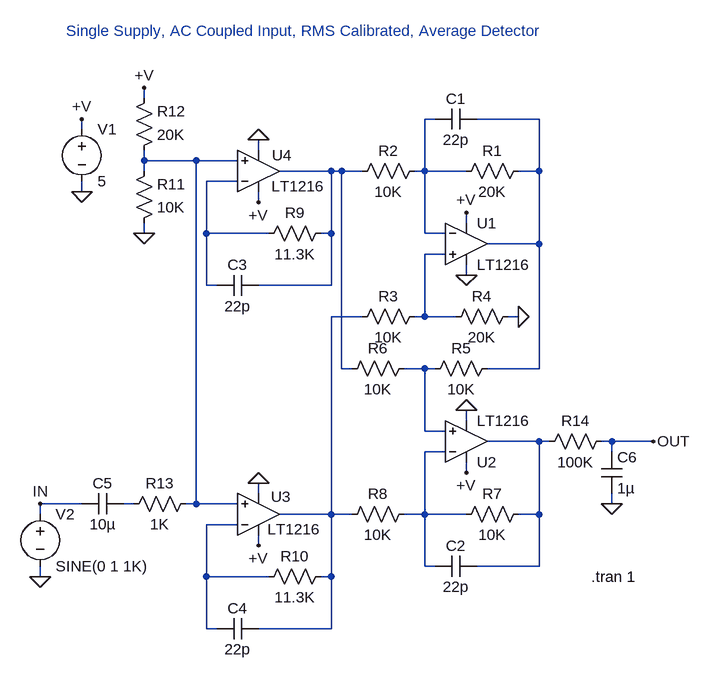
[diagram p0: schematic 1216.asc]
1216.asc, the LTspice schematic file:
Version 4
SHEET 1 896 848
WIRE -432 -64 -432 -80
WIRE 16 -32 0 -32
WIRE 176 -32 80 -32
WIRE -528 -16 -528 -32
WIRE -256 16 -256 0
WIRE -432 32 -432 16
WIRE -352 32 -432 32
WIRE -288 32 -352 32
WIRE -432 48 -432 32
WIRE -144 48 -224 48
WIRE -128 48 -144 48
WIRE -96 48 -128 48
WIRE 0 48 0 -32
WIRE 0 48 -16 48
WIRE 64 48 0 48
WIRE 176 48 176 -32
WIRE 176 48 144 48
WIRE -288 64 -336 64
WIRE -528 80 -528 64
WIRE -256 96 -256 80
WIRE 64 128 64 112
WIRE -432 144 -432 128
WIRE -336 144 -336 64
WIRE -240 144 -336 144
WIRE -144 144 -144 48
WIRE -144 144 -160 144
WIRE 0 144 0 48
WIRE 32 144 0 144
WIRE 176 160 176 48
WIRE 176 160 96 160
WIRE 32 176 0 176
WIRE 64 208 64 192
WIRE -336 224 -336 144
WIRE -320 224 -336 224
WIRE -144 224 -144 144
WIRE -144 224 -256 224
WIRE -96 272 -144 272
WIRE 0 272 0 176
WIRE 0 272 -16 272
WIRE 48 272 0 272
WIRE 144 272 128 272
WIRE -128 352 -128 48
WIRE -112 352 -128 352
WIRE 0 352 -32 352
WIRE 16 352 0 352
WIRE 176 352 176 160
WIRE 176 352 96 352
WIRE 64 432 64 416
WIRE 0 448 0 352
WIRE 32 448 0 448
WIRE 176 464 96 464
WIRE 192 464 176 464
WIRE 288 464 272 464
WIRE 352 464 288 464
WIRE 32 480 0 480
WIRE 288 480 288 464
WIRE 64 512 64 496
WIRE -256 544 -256 528
WIRE -528 560 -592 560
WIRE -448 560 -464 560
WIRE -352 560 -352 32
WIRE -352 560 -368 560
WIRE -288 560 -352 560
WIRE 288 560 288 544
WIRE -592 576 -592 560
WIRE -144 576 -144 272
WIRE -144 576 -224 576
WIRE -112 576 -144 576
WIRE 0 576 0 480
WIRE 0 576 -32 576
WIRE 64 576 0 576
WIRE 176 576 176 464
WIRE 176 576 144 576
WIRE -288 592 -336 592
WIRE -256 624 -256 608
WIRE 0 656 0 576
WIRE 16 656 0 656
WIRE 176 656 176 576
WIRE 176 656 80 656
WIRE -592 672 -592 656
WIRE -336 672 -336 592
WIRE -240 672 -336 672
WIRE -144 672 -144 576
WIRE -144 672 -160 672
WIRE -336 752 -336 672
WIRE -320 752 -336 752
WIRE -144 752 -144 672
WIRE -144 752 -256 752
FLAG -528 80 0
FLAG 64 112 +V
FLAG -528 -32 +V
FLAG -592 672 0
FLAG 64 512 +V
FLAG 64 208 0
FLAG 64 416 0
FLAG -256 96 +V
FLAG -256 0 0
FLAG 144 272 0
FLAG -256 624 +V
FLAG -256 528 0
FLAG -432 144 0
FLAG -432 -80 +V
FLAG 288 560 0
FLAG 352 464 OUT
FLAG -592 560 IN
SYMBOL voltage -528 -32 R0
SYMATTR InstName V1
SYMATTR Value 5
SYMBOL res 160 32 R90
WINDOW 0 0 56 VBottom 2
WINDOW 3 32 56 VTop 2
SYMATTR InstName R1
SYMATTR Value 20K
SYMBOL res 0 32 R90
WINDOW 0 0 56 VBottom 2
WINDOW 3 32 56 VTop 2
SYMATTR InstName R2
SYMATTR Value 10K
SYMBOL voltage -592 560 R0
SYMATTR InstName V2
SYMATTR Value SINE(0 1 1K)
SYMBOL opamps\\LT1216 64 96 R0
SYMATTR InstName U1
SYMBOL opamps\\LT1216 64 528 M180
SYMATTR InstName U2
SYMBOL opamps\\LT1216 -256 112 M180
WINDOW 0 21 88 Left 2
WINDOW 3 20 41 Left 2
SYMATTR InstName U4
SYMBOL res 0 256 R90
WINDOW 0 0 56 VBottom 2
WINDOW 3 32 56 VTop 2
SYMATTR InstName R3
SYMATTR Value 10K
SYMBOL res 144 256 R90
WINDOW 0 0 56 VBottom 2
WINDOW 3 32 56 VTop 2
SYMATTR InstName R4
SYMATTR Value 20K
SYMBOL res 112 336 R90
WINDOW 0 0 56 VBottom 2
WINDOW 3 32 56 VTop 2
SYMATTR InstName R5
SYMATTR Value 10K
SYMBOL res -16 336 R90
WINDOW 0 0 56 VBottom 2
WINDOW 3 32 56 VTop 2
SYMATTR InstName R6
SYMATTR Value 10K
SYMBOL cap 80 -48 R90
WINDOW 0 0 32 VBottom 2
WINDOW 3 32 32 VTop 2
SYMATTR InstName C1
SYMATTR Value 22p
SYMBOL res 160 560 R90
WINDOW 0 0 56 VBottom 2
WINDOW 3 32 56 VTop 2
SYMATTR InstName R7
SYMATTR Value 10K
SYMBOL res -16 560 R90
WINDOW 0 0 56 VBottom 2
WINDOW 3 32 56 VTop 2
SYMATTR InstName R8
SYMATTR Value 10K
SYMBOL cap 80 640 R90
WINDOW 0 0 32 VBottom 2
WINDOW 3 32 32 VTop 2
SYMATTR InstName C2
SYMATTR Value 22p
SYMBOL res -144 128 R90
WINDOW 0 0 56 VBottom 2
WINDOW 3 32 56 VTop 2
SYMATTR InstName R9
SYMATTR Value 11.3K
SYMBOL cap -256 208 R90
WINDOW 0 0 32 VBottom 2
WINDOW 3 32 32 VTop 2
SYMATTR InstName C3
SYMATTR Value 22p
SYMBOL opamps\\LT1216 -256 640 M180
WINDOW 0 19 91 Left 2
WINDOW 3 14 41 Left 2
SYMATTR InstName U3
SYMBOL res -144 656 R90
WINDOW 0 0 56 VBottom 2
WINDOW 3 32 56 VTop 2
SYMATTR InstName R10
SYMATTR Value 11.3K
SYMBOL cap -256 736 R90
WINDOW 0 0 32 VBottom 2
WINDOW 3 32 32 VTop 2
SYMATTR InstName C4
SYMATTR Value 22p
SYMBOL res -448 144 M180
WINDOW 0 36 76 Left 2
WINDOW 3 36 40 Left 2
SYMATTR InstName R11
SYMATTR Value 10K
SYMBOL res -448 32 M180
WINDOW 0 36 76 Left 2
WINDOW 3 36 40 Left 2
SYMATTR InstName R12
SYMATTR Value 20K
SYMBOL res -352 544 R90
WINDOW 0 0 56 VBottom 2
WINDOW 3 32 56 VTop 2
SYMATTR InstName R13
SYMATTR Value 1K
SYMBOL cap -528 576 R270
WINDOW 0 32 32 VTop 2
WINDOW 3 0 32 VBottom 2
SYMATTR InstName C5
SYMATTR Value 10µ
SYMBOL res 288 448 R90
WINDOW 0 0 56 VBottom 2
WINDOW 3 32 56 VTop 2
SYMATTR InstName R14
SYMATTR Value 100K
SYMBOL cap 272 480 R0
SYMATTR InstName C6
SYMATTR Value 1µ
TEXT 256 672 Left 2 !.tran 1
TEXT -184 -152 Bottom 2 ;Single Supply, AC Coupled Input, RMS Calibrated, Average Detector

The netlist it stands for:
* 1216.asc
V1 +V 0 5
R1 N002 N001 20K
R2 N001 N004 10K
V2 IN 0 SINE(0 1 1K)
XU1 N006 N001 +V 0 N002 LT1216  ; pins In+ In- V+ V- OUT
XU2 N008 N010 +V 0 N009 LT1216  ; pins In+ In- V+ V- OUT
XU4 N003 N005 +V 0 N004 LT1216  ; pins In+ In- V+ V- OUT
R3 N006 N007 10K
R4 0 N006 20K
R5 N002 N008 10K
R6 N008 N004 10K
C1 N002 N001 22p
R7 N009 N010 10K
R8 N010 N007 10K
C2 N009 N010 22p
R9 N004 N005 11.3K
C3 N004 N005 22p
XU3 N003 N012 +V 0 N007 LT1216  ; pins In+ In- V+ V- OUT
R10 N007 N012 11.3K
C4 N007 N012 22p
R11 0 N003 10K
R12 N003 +V 20K
R13 N003 N011 1K
C5 IN N011 10µ
R14 OUT N009 100K
C6 OUT 0 1µ
.tran 1
* Single Supply, AC Coupled Input, RMS Calibrated, Average Detector
.backanno
.end